# EAGLE design daughter board V1 (EAGLE 8.1.0)
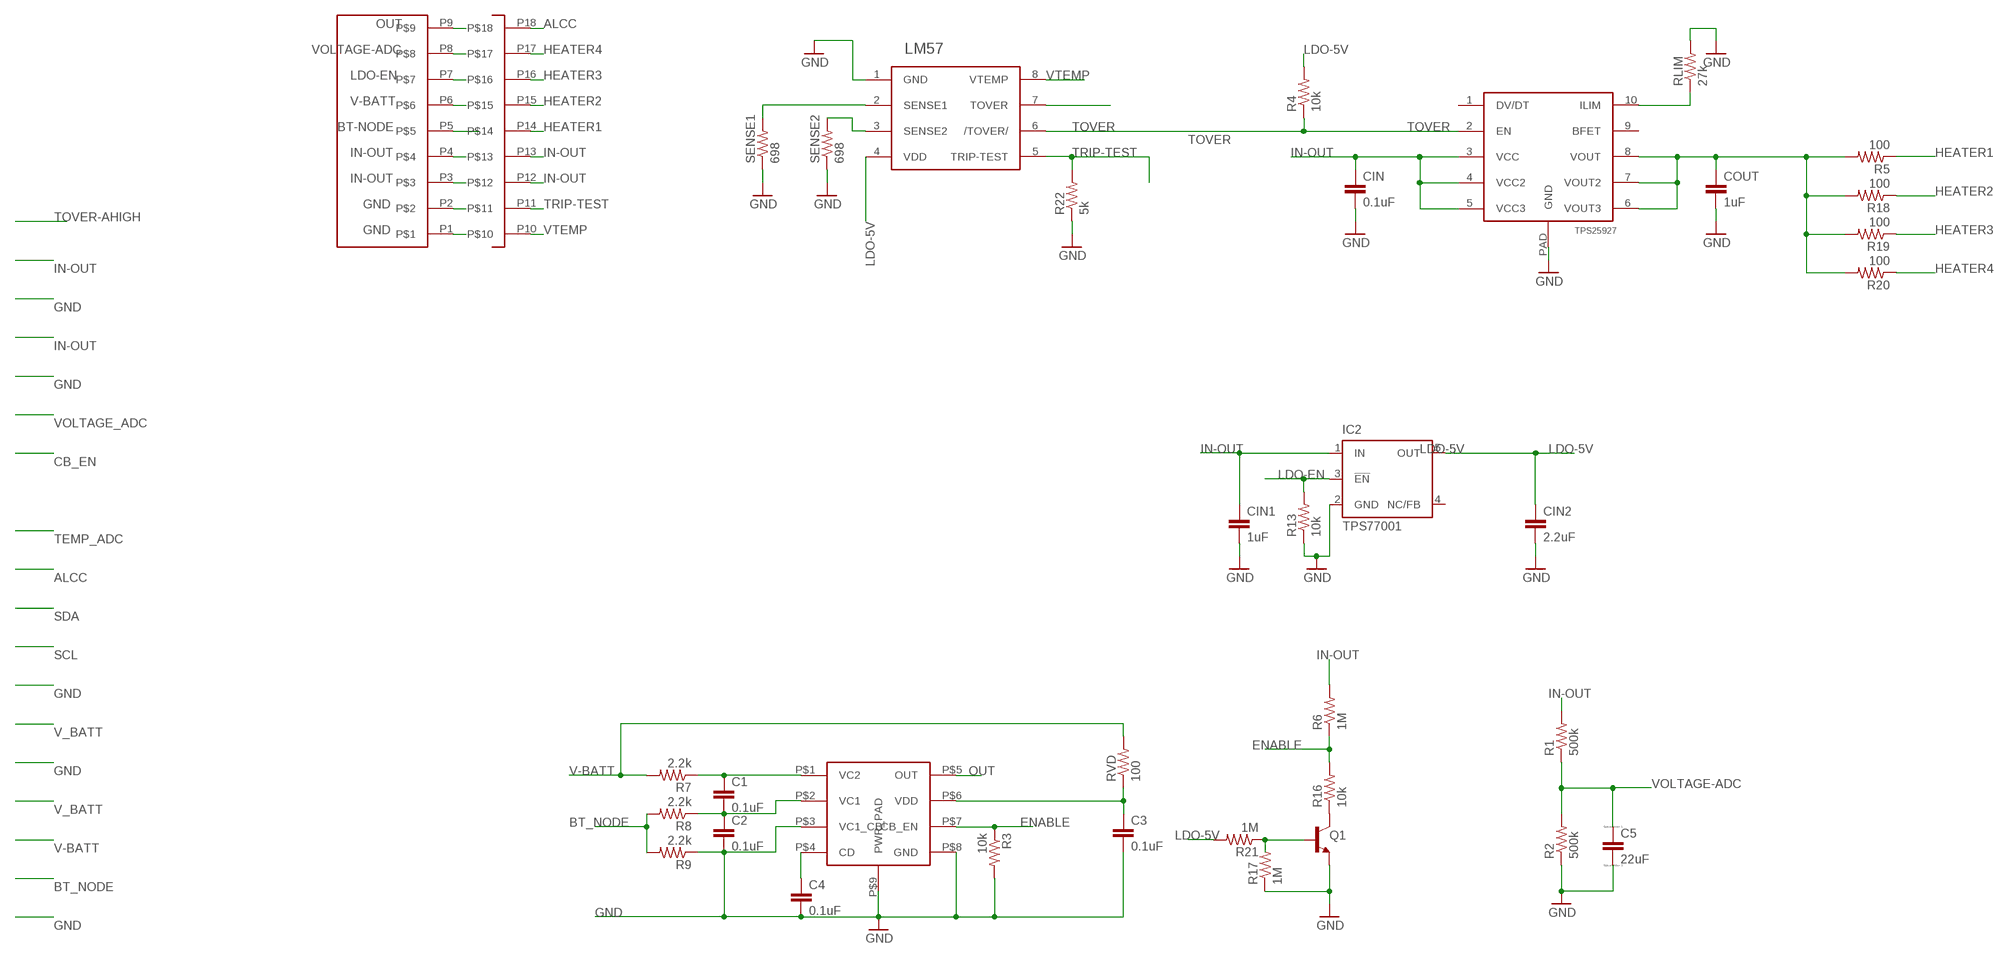
[diagram p0: schematic, sheet 1]

## Parts
C1  0.1uF  .1UF-CER  [0402-CAP]
C2  0.1uF  .1UF-CER  [0402-CAP]
C3  0.1uF  .1UF-CER  [0402-CAP]
C4  0.1uF  .1UF-CER  [0402-CAP]
C5  22uF  CC1206  [C1206]
CIN  0.1uF  .1UF-CER  [0402-CAP]
CIN1  1uF  .1UF-CER  [0402-CAP]
CIN2  2.2uF  .1UF-CER  [0402-CAP]
COUT  1uF  .1UF-CER  [0402-CAP]
IC2  TPS77001  [SOT23-DBV]
Q1  TRANS_NPN-MMBT2222AL  [SOT23-3]
R1  500k  R-US_R0805  [R0805]
R2  500k  R-US_R0805  [R0805]
R3  10k  R-US_R0805  [R0805]
R4  10k  R-US_R0805  [R0805]
R5  100  R-US_R0805  [R0805]
R6  1M  R-US_R0805  [R0805]
R7  2.2k  R-US_R0805  [R0805]
R8  2.2k  R-US_R0805  [R0805]
R9  2.2k  R-US_R0805  [R0805]
R13  10k  R-US_R0805  [R0805]
R16  10k  R-US_R0805  [R0805]
R17  1M  R-US_M0805  [M0805]
R18  100  R-US_R0805  [R0805]
R19  100  R-US_R0805  [R0805]
R20  100  R-US_R0805  [R0805]
R21  1M  R-US_M0805  [M0805]
R22  5k  R-US_R0805  [R0805]
RLIM  27k  R-US_R0805  [R0805]
RVD  100  R-US_R0805  [R0805]
SENSE1  698  R-US_R0805  [R0805]
SENSE2  698  R-US_R0805  [R0805]
U$2  LM57  [TSSOP-8]
U$5  TPS252927  [VSON10]
U$7  FFC18  [FFC18]
U$8  BQ29209  [VSON8]

## Nets
ALCC: U$7.P18
BASE: Q1.1(B) R17.2 R21.1
BT-NODE: U$7.P5
BT_NODE: R8.2 R9.2
ENABLE: R3.1 R6.1 R16.2 U$8.P$7(CB_EN)
GND: C2.2 C3.2 C4.2 C5.2 CIN1.2 CIN2.2 CIN.2 COUT.2 IC2.2(GND) Q1.2(E) R2.1 R3.2 R9.1 R13.1 R17.1 R22.1 RLIM.2 SENSE1.1 SENSE2.1 U$2.1(GND) U$5.PAD(GND) U$7.P1 U$7.P2 U$8.P$3(VC1_CB) U$8.P$8(GND) U$8.P$9(PWR_PAD)
HEATER1: R5.1 U$7.P14
HEATER2: R18.1 U$7.P15
HEATER3: R19.1 U$7.P16
HEATER4: R20.1 U$7.P17
IN-OUT: CIN1.1 CIN.1 IC2.1(IN) R1.2 R6.2 U$5.3(VCC) U$5.4(VCC2) U$5.5(VCC3) U$7.P3 U$7.P4 U$7.P12 U$7.P13
LDO-5V: CIN2.1 IC2.5(OUT) R4.2 R21.2 U$2.4(VDD)
LDO-EN: IC2.3(!EN) R13.2 U$7.P7
N$1: SENSE1.2 U$2.2(SENSE1)
N$2: C1.1 R7.1 U$8.P$1(VC2)
N$4: C1.2 C2.1 R8.1 U$8.P$2(VC1)
N$5: C3.1 RVD.1 U$8.P$6(VDD)
N$7: Q1.3(C) R16.1
N$8: C4.1 U$8.P$4(CD)
N$9: COUT.1 R5.2 R18.2 R19.2 R20.2 U$5.6(VOUT3) U$5.7(VOUT2) U$5.8(VOUT)
N$10: RLIM.1 U$5.10(ILIM)
N$11: SENSE2.2 U$2.3(SENSE2)
N$13: U$2.7(TOVER)
OUT: U$7.P9 U$8.P$5(OUT)
TOVER: R4.1 U$2.6(/TOVER/) U$5.2(EN)
TRIP-TEST: R22.2 U$2.5(TRIP-TEST) U$7.P11
V-BATT: R7.2 RVD.2 U$7.P6
VOLTAGE-ADC: C5.1 R1.1 R2.2 U$7.P8
VTEMP: U$2.8(VTEMP) U$7.P10
Unconnected: IC2.4(NC/FB) U$5.1(DV/DT) U$5.9(BFET)

## Library data of the parts
C1-C4 CIN = SparkFun-Retired:.1UF-CER: .1uF ceramic SMT CAP-00810- 25V +80%/-20% (0603) CAP-08390- 100V 10% (0603) CAP-08604- 25V 5% (0603); PROD_ID: CAP-00810
C5 = eagle-ltspice:C: CAPACITOR, European symbol; SPICEMODEL: NONE; SPICEPREFIX: C
CIN1 CIN2 COUT = SparkFun-Retired:.1UF-CER: .1uF ceramic SMT CAP-00810- 25V +80%/-20% (0603) CAP-08390- 100V 10% (0603) CAP-08604- 25V 5% (0603); PROD_ID: CAP-00810; VALUE: 0.1uF
IC2 = texas:TPS770*: ULTRALOW-POWER 50-mA LOW-DROPOUT LINEAR REGULATORS 50-mA Low-Dropout Regulator Source: http://focus.ti.com/lit/ds/symlink/tps77001.pdf; MF: TEXAS INSTRUMENTS; MPN: TPS77001DBVT; OC_FARNELL: 8461554; OC_NEWARK: 77C1171
Q1 = SparkFun-DiscreteSemi:TRANS_NPN: NPN transistor Current controlled devices typically used to amplify current or used as a switch. BC547 - COM-08928 <http://www.sparkfun.com/products/8928> (TO-92 45V 100mA) (1.Collector 2.Base 3.Emitter) 2N3904 - COM-00521 <http://www.sparkfun.com/products/521> (TO-92 40V 200mA) (1.Emitter 2.Base 3.Collector) P2N2222A - COM-12852 <http://www.sparkfun.com/products/12852> (TO-92 40V 600mA) (1.Collector 2.Base 3.Emitter); PROD_ID: TRANS-08049; VALUE: 600mA/40V
R1-R9 R13 R16-R22 RLIM RVD SENSE1 SENSE2 = rcl:R-US_: RESISTOR, American symbol
U$2 = Parts for Power Team:LM57
U$5 = Parts for Power Team1:TPS252927: http://www.ti.com/product/tps25927/datasheet
U$7 = Parts for Power Team1:FFC18
U$8 = Parts for Power Team1:BQ29209

## Board
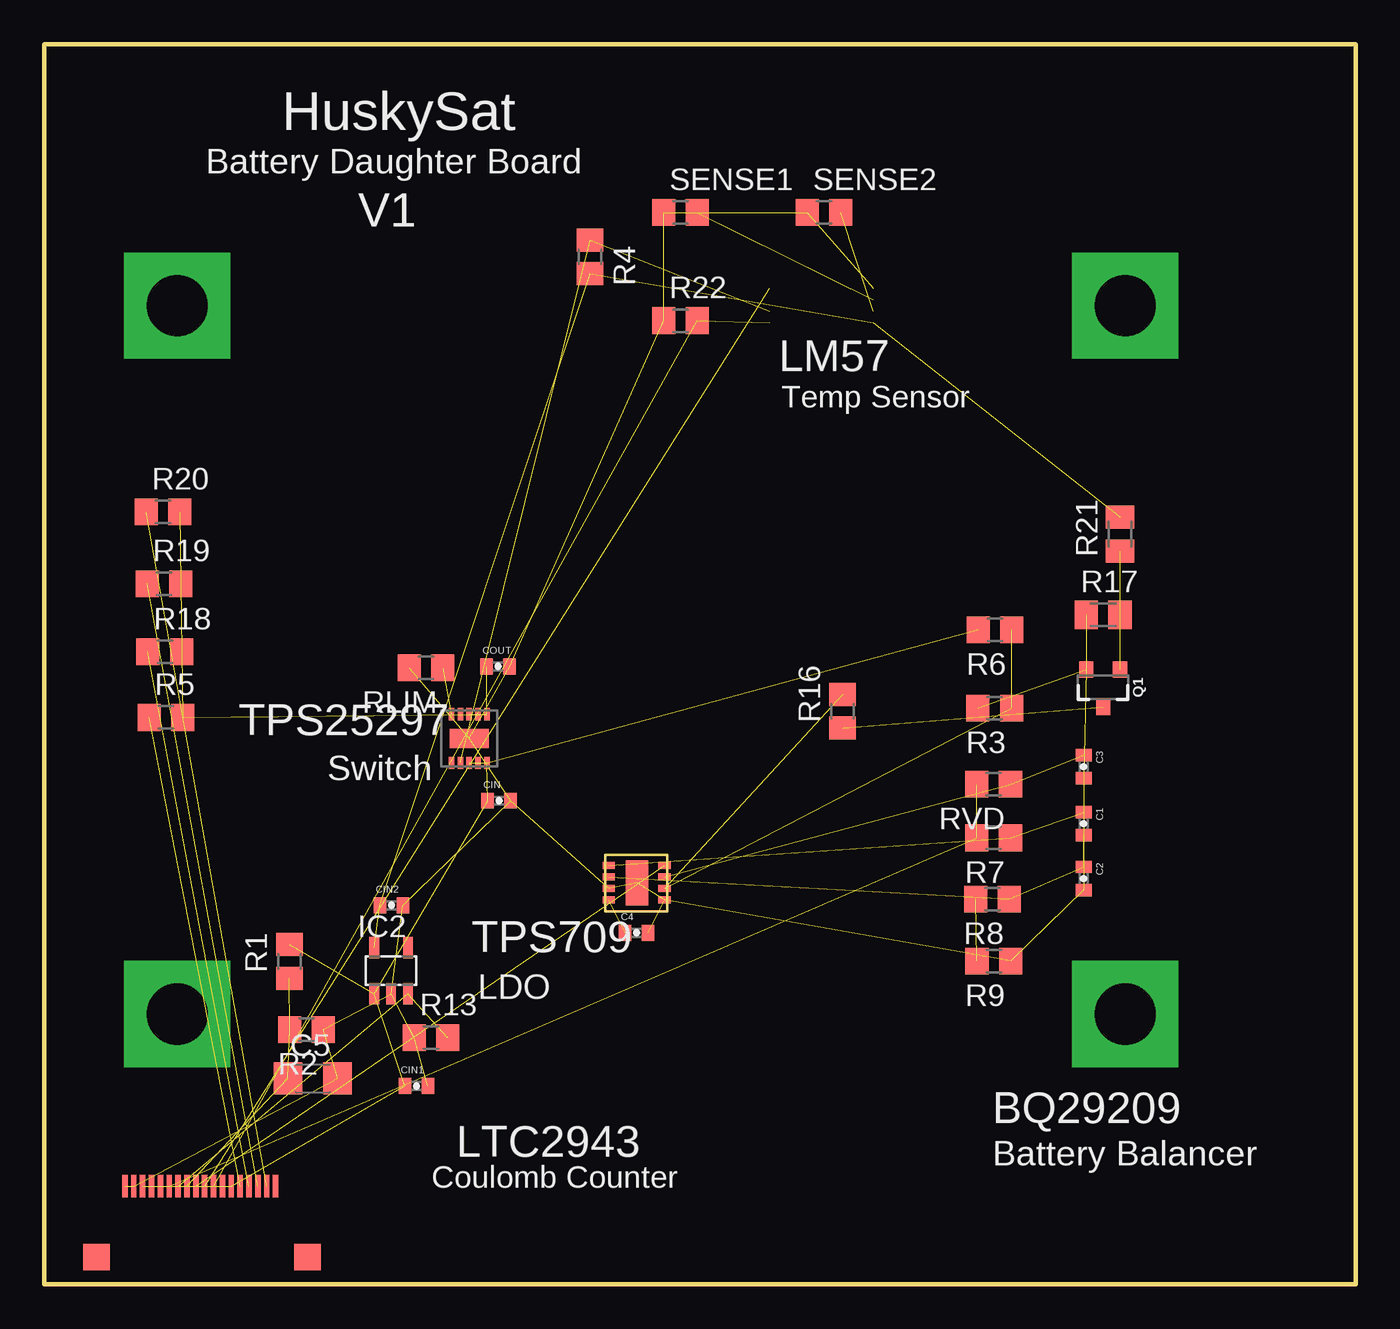
[diagram p1: board, top side]
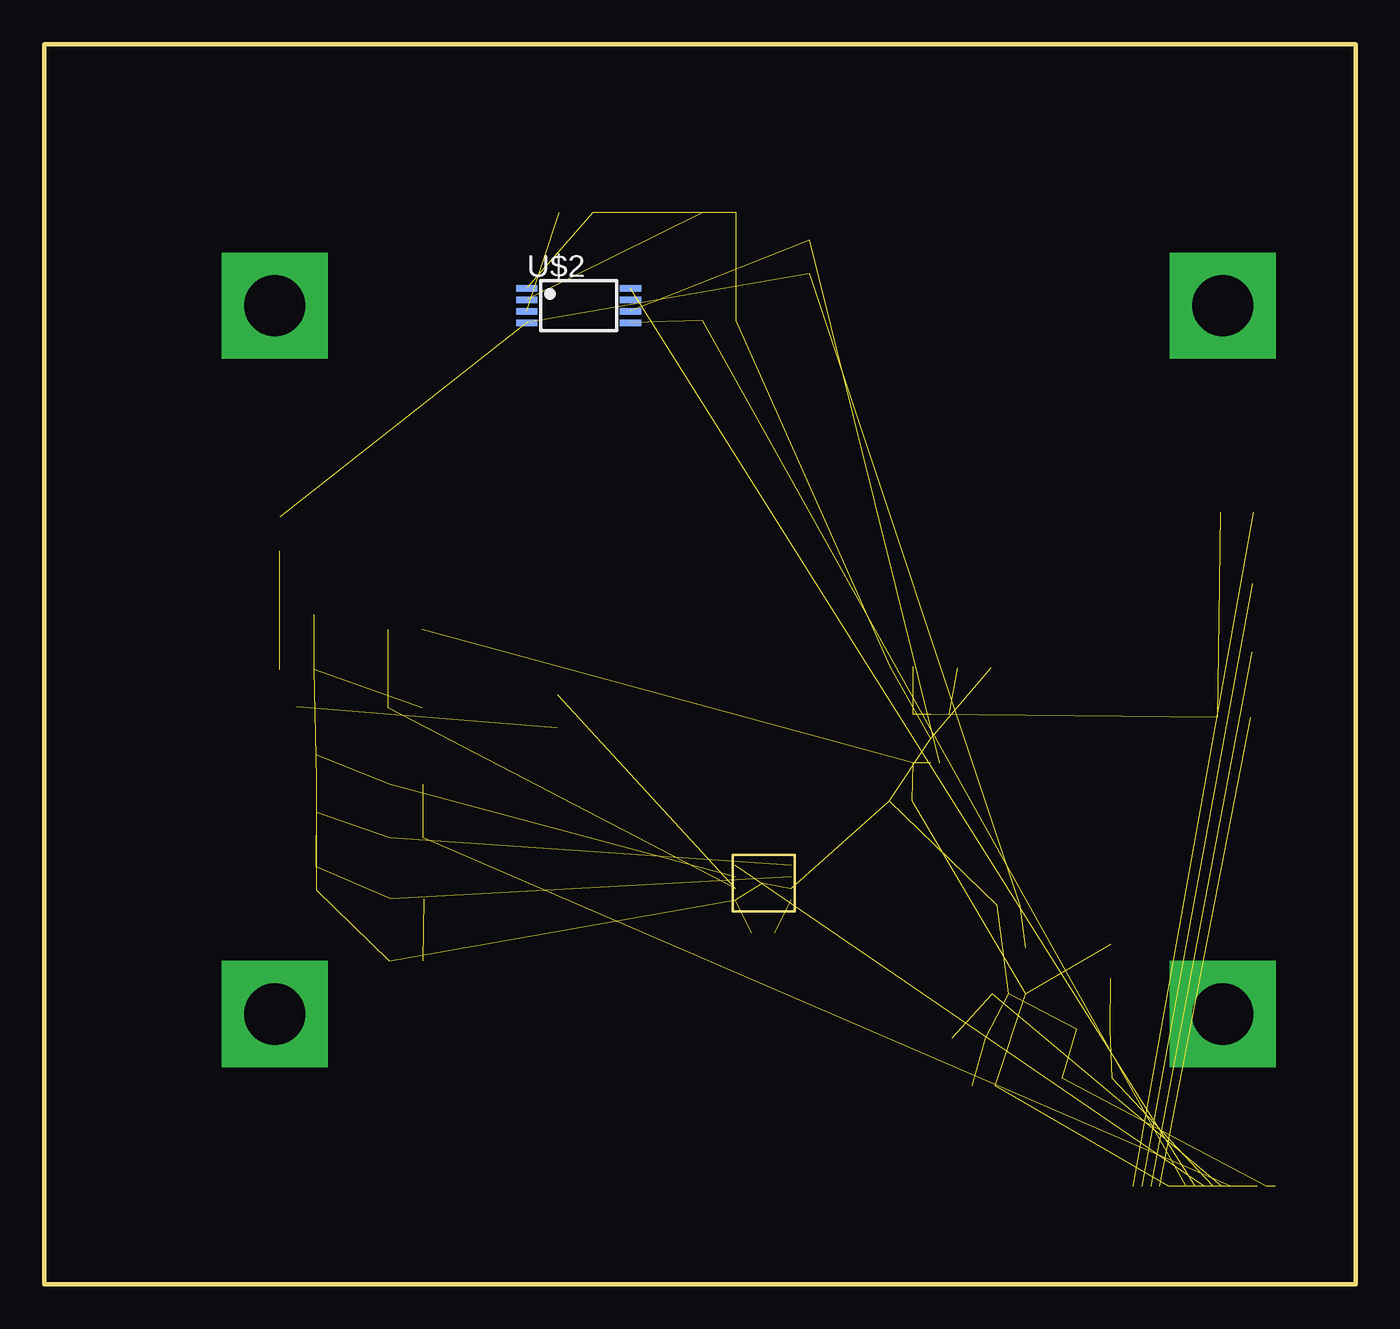
[diagram p2: board, bottom side, seen from below]

Size 74 x 70 mm. Coordinates in mm from the lower left corner, seen from the top.
Outline: 0,0 0,70 74,70 74,0 0,0
Copper layers (1*16): Top 0.035mm / dielectric 1.5mm / Bottom 0.035mm
Design rules "default": minimum track width 10mil, minimum drill 24mil, track to track 8mil, track to pad 8mil, pad to pad 8mil, via to via 8mil, smd to smd 8mil, copper to edge 40mil, drill to drill 8mil, minimum pad ring 10mil, minimum via ring 8mil, stop-mask expansion 4mil, vias tented up to drill 0mil, thermal gap 10mil

### Footprints (pad centres in the part's own frame; a part is rotated, then mirrored left to right if it is on the bottom)
0402-CAP = smd 0.7 x 0.9: 1 -0.65,0; 2 0.65,0
C1206 = smd 1.6 x 1.8: 1 -1.4,0; 2 1.4,0
SOT23-DBV = smd 0.55 x 1.2: 1 -0.95,-1.3; 2 0,-1.3; 3 0.95,-1.3; 4 0.95,1.3; 5 -0.95,1.3
SOT23-3 = smd 0.8 x 0.9: 1 -0.95,-1; 2 0.95,-1; 3 0,1.1
R0805 = smd 1.3 x 1.5: 1 -0.95,0; 2 0.95,0
M0805 = smd 1.3 x 1.6: 1 -0.95,0; 2 0.95,0
TSSOP-8 = smd 1.2 x 0.35: 1 -4.175,1.725; 2 -4.175,1.075; 3 -4.175,0.425; 4 -4.175,-0.225; 5 1.675,-0.225; 6 1.675,0.425; 7 1.675,1.075; 8 1.675,1.725
VSON10 = smd 0.7 x 0.305: 1 0.2,2.575; 2 0.2,2.075; 3 0.2,1.575; 4 0.2,1.075; 5 0.2,0.575; 6 2.95,0.575; 7 2.95,1.075; 8 2.95,1.575; 9 2.95,2.075; 10 2.95,2.575 | smd 1.067 x 2.184: PAD 1.575,1.575
FFC18 = smd 1.5 x 1.5: MOUNT1 0.75,0.75; MOUNT2 12.65,0.75 | smd 0.305 x 1.27: P1 2.35,4.735; P2 2.85,4.735; P3 3.35,4.735; P4 3.85,4.735; P5 4.35,4.735; P6 4.85,4.735; P7 5.35,4.735; P8 5.85,4.735; P9 6.35,4.735; P10 6.85,4.735; P11 7.35,4.735; P12 7.85,4.735; P13 8.35,4.735; P14 8.85,4.735; P15 9.35,4.735; P16 9.85,4.735; P17 10.35,4.735; P18 10.85,4.735; P$9 10.35,4.735
VSON8 = smd 0.4 x 0.7: P$1 0,0; P$2 0.65,0; P$3 1.3,0; P$4 1.95,0; P$5 0,3.15; P$6 0.65,3.15; P$7 1.3,3.15; P$8 1.95,3.15 | smd 2.54 x 1.27: P$9 1,1.6

### Placement (x,y rotation side)
C1  58.65,26 270 top
C2  58.65,22.91 270 top
C3  58.65,29.22 270 top
C4  33.42,19.85 0 top
C5  15.15,11.63 0 top
CIN  25.66,27.3 0 top
CIN1  21,11.2 0 top
CIN2  19.59,21.4 0 top
COUT  25.61,34.88 0 top
IC2  19.57,17.7 0 top
Q1  59.75,33.7 180 top
R1  13.83,18.23 90 top
R2  14.8,14.38 180 top
R3  53.63,32.53 180 top
R4  30.8,58 270 top
R5  6.86,32 0 top
R6  53.65,36.95 180 top
R7  53.57,25.2 180 top
R8  53.5,21.75 180 top
R9  53.58,18.25 180 top
R13  21.82,13.92 0 top
R16  45.05,32.35 90 top
R17  59.75,37.8 0 top
R18  6.8,35.7 0 top
R19  6.75,39.55 0 top
R20  6.7,43.6 0 top
R21  60.7,42.35 90 top
R22  35.9,54.4 0 top
RLIM  21.54,34.8 180 top
RVD  53.57,28.23 180 top
SENSE1  35.9,60.5 0 top
SENSE2  44,60.5 0 top
U$2  42.6,54.5 0 bottom
U$5  25.55,29.23 90 top
U$7  2.2,0.8 0 top
U$8  31.85,23.65 270 top

### Tracks (layer width: path | path; a pad name or v marks a point on that pad's centre or on a via)
BASE  (2 unrouted)
BT_NODE  (1 unrouted)
ENABLE  (3 unrouted)
GND  (25 unrouted)
HEATER1  (1 unrouted)
HEATER2  (1 unrouted)
HEATER3  (1 unrouted)
HEATER4  (1 unrouted)
IN-OUT  (11 unrouted)
LDO-5V  (4 unrouted)
LDO-EN  (2 unrouted)
N$1  (1 unrouted)
N$2  (2 unrouted)
N$3  (via drill 3.45 pad 6)
  other vias: 61,15.25
N$4  (3 unrouted)
N$5  (2 unrouted)
N$6  (via drill 3.45 pad 6)
  other vias: 61,55.25
N$7  (1 unrouted)
N$8  (1 unrouted)
N$9  (7 unrouted)
N$10  (1 unrouted)
N$11  (1 unrouted)
N$12  (via drill 3.45 pad 6)
  other vias: 7.5,15.25
N$14  (via drill 3.45 pad 6)
  other vias: 7.5,55.25
OUT  (1 unrouted)
TOVER  (2 unrouted)
TRIP-TEST  (2 unrouted)
V-BATT  (2 unrouted)
VOLTAGE-ADC  (3 unrouted)
VTEMP  (1 unrouted)

### Text on the board
tSilk: HuskySat | Battery Daughter Board | V1 | LM57 | Temp Sensor | TPS25297 | Switch | TPS709 | LDO | BQ29209 | LTC2943 | Battery Balancer | Coulomb Counter